# EAGLE design BackscatterPlantSensor_v2_test2 (EAGLE 6.4)

## Sheet 1 of 3
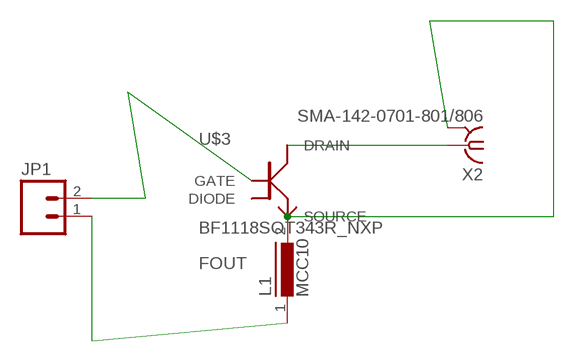
[diagram p0: schematic, sheet 1]

### Parts
JP1  M02PTH  [1X02]
L1  MCC10  [MCC10]
U$3  BF1118SOT343R_NXP  [SOT343R]
X2  SMA-142-0701-801/806  [J502-ND-142-0701-801/806]

### Nets
DGND: JP1.2 U$3.1(GATE)
DRAIN: U$3.4(DRAIN) X2.1
FOUT: JP1.1 L1.1
FOUT2: L1.2 U$3.3(SOURCE) X2.G@1(GND)
Unconnected: U$3.2(DIODE)

## Sheet 2 of 3

## Sheet 3 of 3

## Power pins joined to a net without a drawn wire
GND: X2.G@2(GND) X2.G@3(GND) X2.G@4(GND)

## Library data of the parts
JP1 = SparkFun-Connectors:M02: Header 2 Standard 2-pin 0.1" header. Use with straight break away headers (SKU : PRT-00116), right angle break away headers (PRT-00553), swiss pins (PRT-00743), machine pins (PRT-00117), and female headers (PRT-00115). Molex polarized connector foot print use with SKU : PRT-08233 with associated crimp pins and housings.
L1 = inductors:MCC10: INDUCTOR
U$3 = rf_transistors:BF1118
X2 = con-coax:SMA-: SMA 50 Ohm End Launch Jack Receptacle - Round Contact Johnson Components Source: www.johnsoncomponents.com .. J502-ND.pdf; MF: JOHNSON COMPONENTS; MPN: 142-0701-801; OC_FARNELL: 1608592; OC_NEWARK: 90F2624

## Board
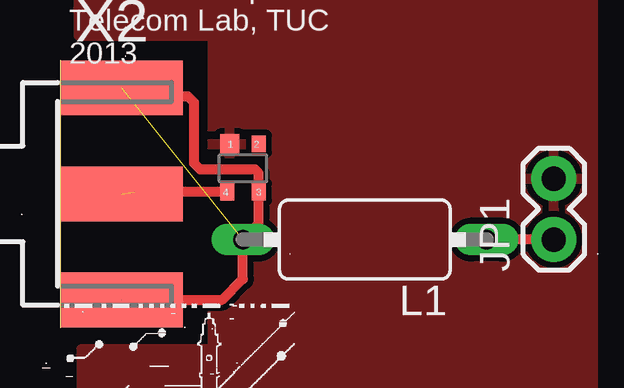
[diagram p1: board, top side]
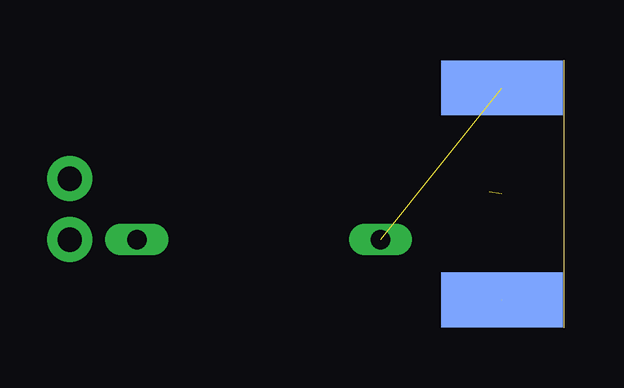
[diagram p2: board, bottom side, seen from below]

Size 0 x 11.18 mm. Coordinates in mm from the lower left corner, seen from the top.
Copper layers (1*16): Top 0.035mm / dielectric 1.5mm / Bottom 0.035mm
Design rules "Fusion_eagle_rule_v1.1 *": minimum track width 6mil, minimum drill 12mil, track to track 10mil, track to pad 10mil, pad to pad 10mil, via to via 10mil, smd to smd 0mil, copper to edge 10mil, drill to drill 10mil, minimum pad ring 10mil, minimum via ring 6mil, stop-mask expansion 2mil, vias tented up to drill 100mil, thermal gap 10mil

### Footprints (pad centres in the part's own frame; a part is rotated, then mirrored left to right if it is on the bottom)
1X02 = drill 1.016 pad 1.88: 1 0,0; 2 2.54,0
MCC10 = drill 0.813 long: 1 -5.08,0; 2 5.08,0
SOT343R = smd 0.8 x 0.8: 1 0.55,-1.07 | smd 0.6 x 0.7: 2 -0.66,-1.07; 3 -0.66,0.94; 4 0.65,0.94
J502-ND-142-0701-801/806 = smd 5.08 x 2.286: 1 2.565,0; G@1 2.565,4.42; G@2 2.565,-4.42 | smd 5.08 x 2.286 bottom: G@3 2.565,4.42; G@4 2.565,-4.42

### Placement (x,y rotation side)
JP1  20.57,3.68 90 top  (outside the outline)
L1  12.7,3.68 180 top  (outside the outline)
U$3  7.62,6.6 180 top  (outside the outline)
X2  0,5.59 0 top

### Tracks (layer width: path | path; a pad name or v marks a point on that pad's centre or on a via)
DGND
  pour Top: 0.76,16 0.76,12.19 6.35,12.19 6.35,-0.89 0.89,-0.89 0.89,-5.46 22.23,-5.46 22.23,16
DRAIN  (1 unrouted)
  Top 0.406: U$3.4 3.1,5.66
FOUT
  Top 0.406: JP1.1 L1.1
FOUT2
  Top 0.406: 8.24,5.58 U$3.3 | L1.2 8.28,4.34 U$3.3 | U$3.3 8.28,6.45 8.13,6.6 5.84,6.6 5.59,6.86 5.59,9.4 5.33,9.65 2.03,9.65 X2.G@1
GND  (2 unrouted)
  Top 0.406: X2.G@4 6.76,1.17 7.62,2.03 7.62,3.68

### Text on the board
tPlace: J. Kimionis / K. Tountas / E. Kampianakis / C. Konstantopoulos / Telecom Lab, TUC / 2013